# Altium project CRD25DA12N-FMC V1-1 (07-2023).PrjPcb (part 3 of 8)
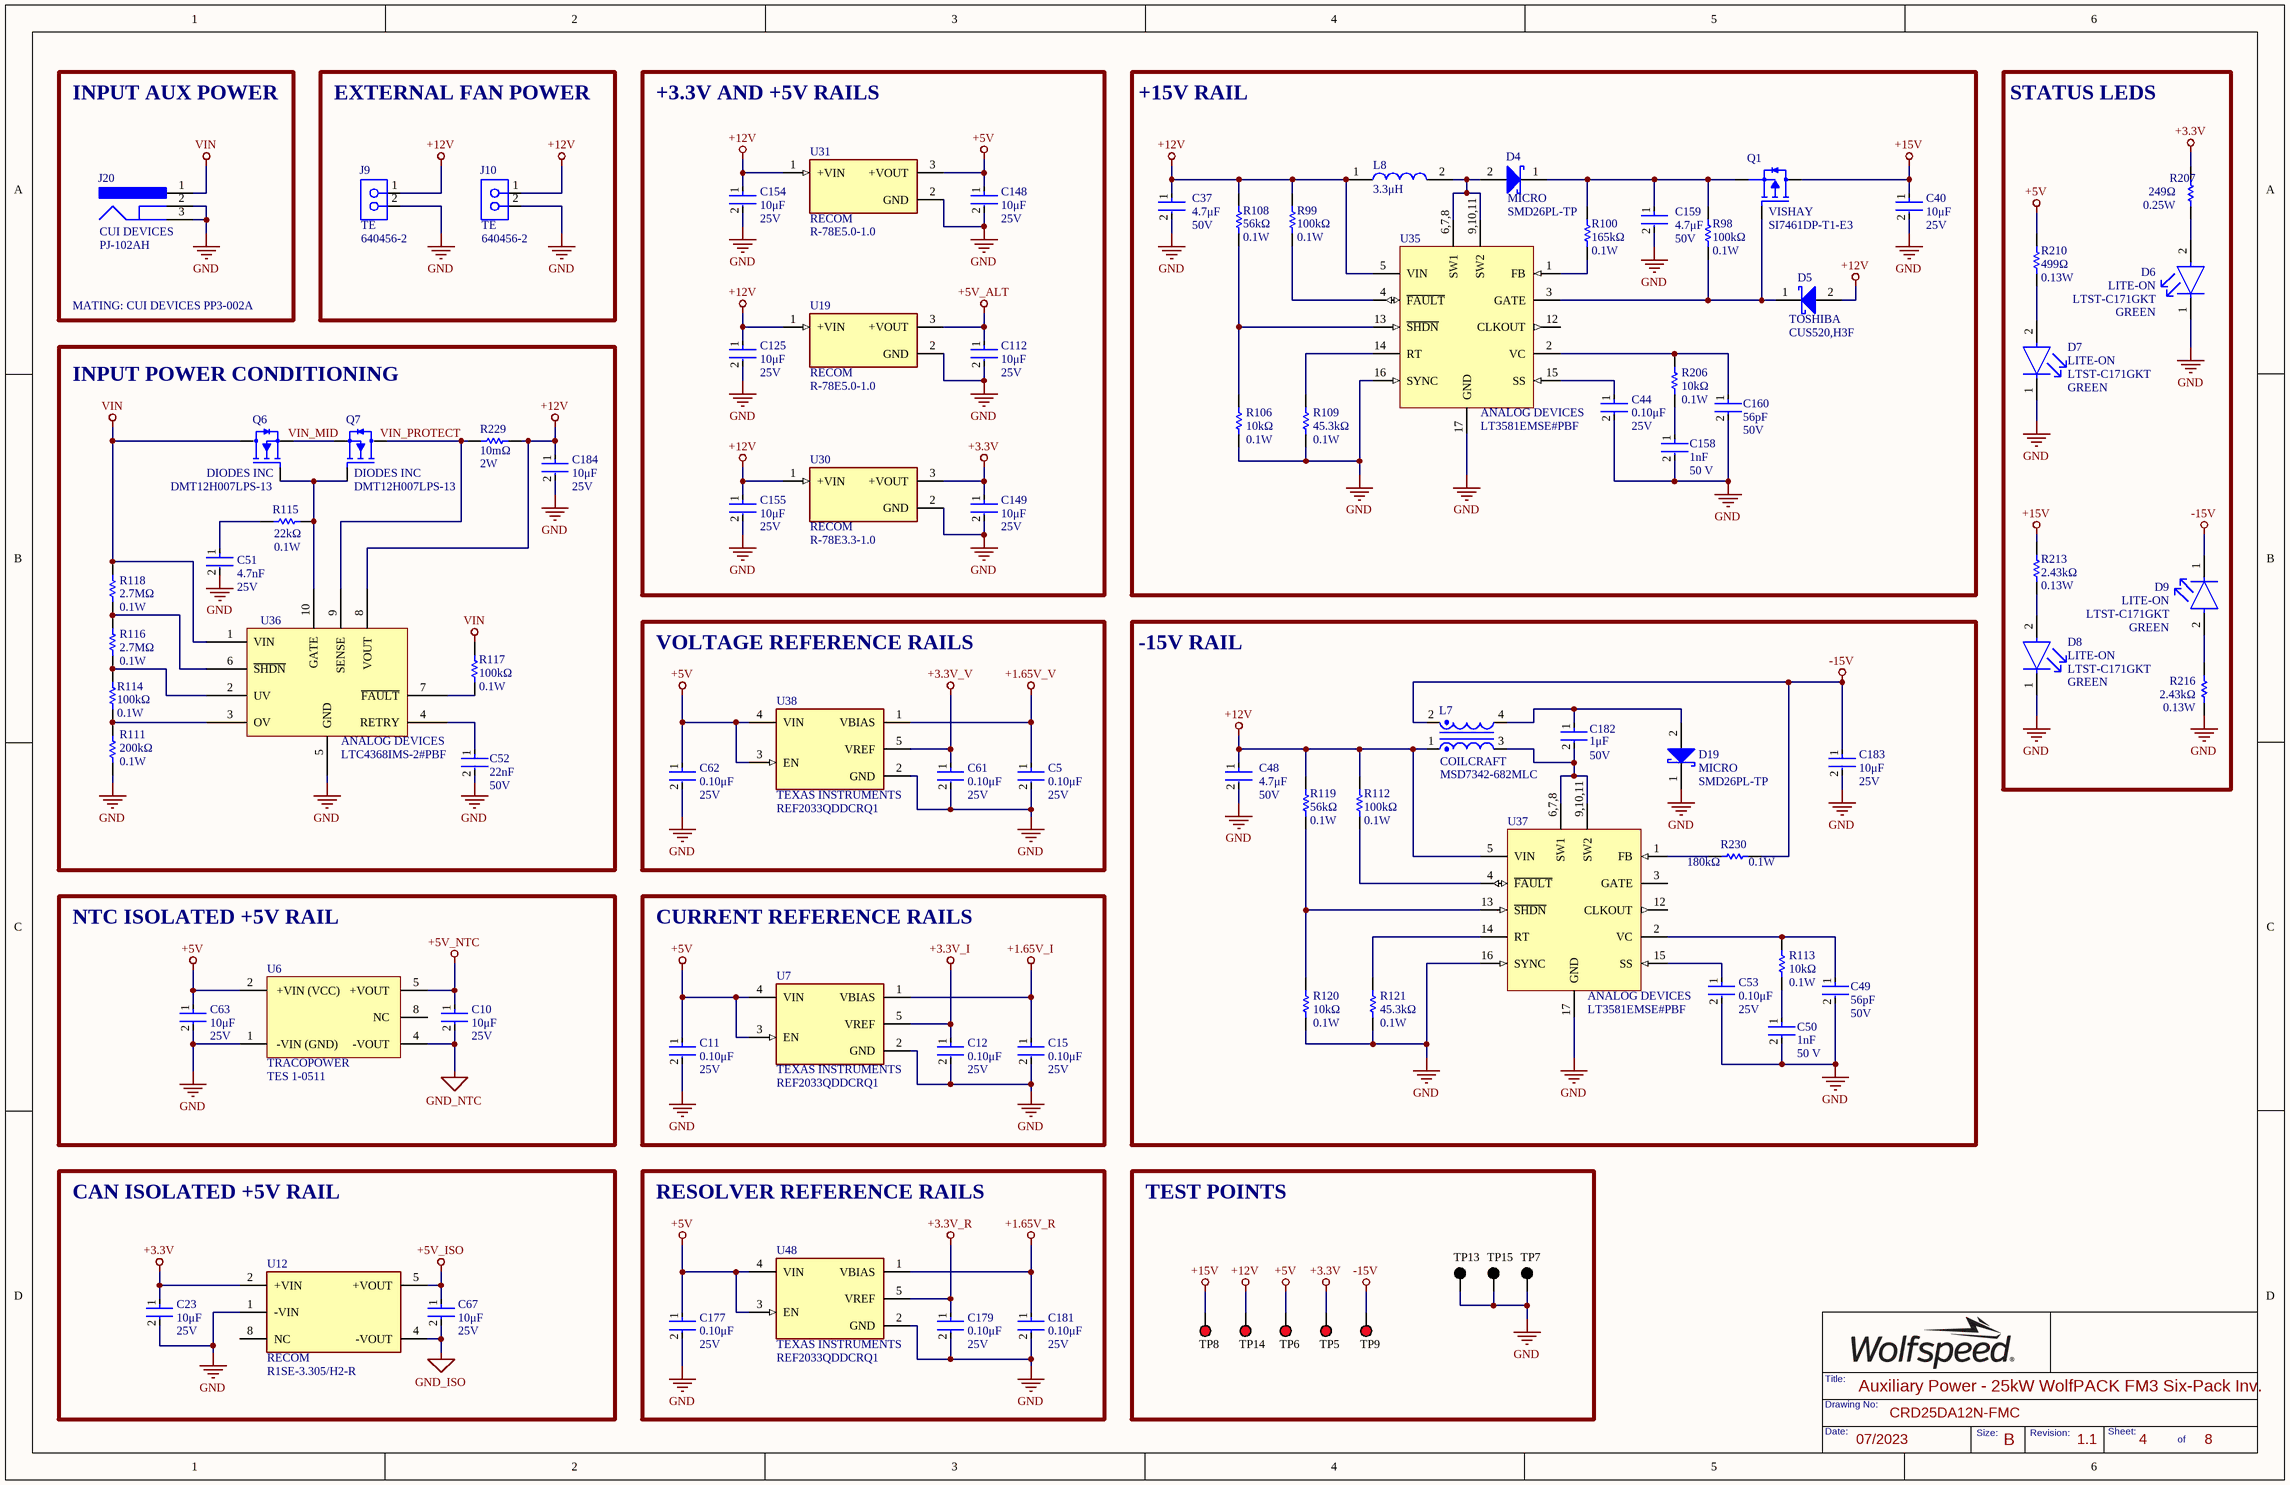
[diagram p8: 04 - Auxiliary Power.SchDoc]

## Sheet 04 - Auxiliary Power.SchDoc: Auxiliary Power - 25kW WolfPACK FM3 Six-Pack Inv. (continued)
### Library data of the parts
C5 C11 C12 C15 C44 C53 C61 C62 C177 C179 C181 = CMP-2006-03057-2: CAP CER 0.1UF 25V X7R 0603; Manufacturer: KEMET; Value: 0.10μF; Material: Ceramic; Tolerance: 0.1; Temperature Coefficient: 30ppm/°C; Automotive Grade: Grade 1; Lead Free: Yes; Device Class L3: Ceramic Capacitors; Manufacturer Part Number: C0603C104K3RACTU; Digikey Description: CAP CER 0.1UF 25V X7R 0603; Mouser Description: Multilayer Ceramic Capacitors MLCC - SMD/SMT 25volts 0.1uF X7R 10%; Package: 0603; Temperature Range Low: -55°C; Automotive: Yes; Device Class L2: Capacitors; Octopart: https://octopart.com/c0603c104k3ractu-kemet-127541; ComponentLink2Description: Datasheet; ComponentLink2URL: https://api.kemet.com/component-edge/download/datasheet/C0603C100J5GACAUTO.pdf; Temperature Range High: +125°C; RoHS: TRUE; Device Class L1: Passive Components; Category: Cap; Temperature: -55°C to +125°C; Height: 0.87mm; Temperature Characteristic: X7R
C10 C23 C40 C63 C67 C112 C125 C148 C149 C154 C155 C183 C184 = CMP-13271-001434-1: CAP CER 10UF 25V X7R 1206; Manufacturer: SAMSUNG; Tolerance: 10%; Value: 10μF; Max Operating Temperature: 125°C; Dielectric: X7R; Min Operating Temperature: -55°C; Height: 1.6mm; Mount: Surface Mount; Width: 0.063inch; Thickness: 0.071inch; Case Code (Metric): 3216; Contact Plating: Tin; Packaging: Tape and Reel; Package: 1206; Case Code (Imperial): 1206; Length: 0.126inch; Radiation Hardening: No; Package Quantity: 1; Depth: 1.6mm; Manufacturer Part Number: CL31B106KAHSFNE
C37 C48 C159 = CMP-13271-001123-1: CAP CER 4.7UF 50V X7R 1206; Manufacturer: SAMSUNG; Tolerance: 10%; Value: 4.7μF; Depth: 1.6mm; Max Operating Temperature: 125°C; Case Code (Metric): 3216; Packaging: Tape and Reel; Mount: Surface Mount; Min Operating Temperature: -55°C; Thickness: 0.071inch; Package: 1206; Length: 3.2mm; Dielectric: X7R; Case Code (Imperial): 1206; Height: 1.6mm; Package Quantity: 1; Radiation Hardening: No; Width: 0.063inch; Manufacturer Part Number: CL31B475KBHNFNE
C49 C160 = CL10C560JB8NNNC: CAP CER 56PF 50V C0G/NP0 0603; Manufacturer: SAMSUNG; Material: Ceramic; Tolerance: 5%; Dielectric: C0G; Temperature Coefficient: 30ppm/°C; Supplier 1: Arrow Electronics; Manufacturer Part Number: CL10C560JB8NNNC; RoHS: Yes; Category: Ceramic Capacitors; Stock 1: 60182; Pricing 1: 1=0.05960, 10=0.01370, 25=0.01360, 100=0.01080, 250=0.01070, 500=0.00740, 1000=0.00590, 3000=0.00560, 6000=0.00530, 15000=0.00500, 30000=0.00470 (USD); Mount: Surface Mount; Case Code (Metric): 1608; Case Code (Imperial): 0603; Min Operating Temperature: -55°C; Max Operating Temperature: 125°C; Packaging: Tape and Reel; Package Quantity: 1; Voltage: 50V; Voltage Rating (DC): 50V; Series: CL; Construction: Flat; Termination: SMD/SMT; Length: 1.6mm; Width: 0.031inch; Height: 0.8mm; Thickness: 0.035inch; Depth: 0.8mm; Radiation Hardening: No; Lead Free: Lead Free; RoHS Compliant: Yes; ComponentLink1URL: https://datasheet.ciiva.com/25803/cl10c560jb8nnnc-25803592.pdf?src-supplier=Digi-Key; ComponentLink1Description: https://datasheet.ciiva.com/25803/cl10c560jb8nnnc-25803592.pdf?src-supplier=Digi-Key; ComponentLink2URL: https://datasheet.ciiva.com/26838/getdatasheetpartid-640760-26838546.pdf?src-supplier=Verical; ComponentLink2Description: https://datasheet.ciiva.com/26838/getdatasheetpartid-640760-26838546.pdf?src-supplier=Verical; ComponentLink3URL: https://datasheet.ciiva.com/29198/456837-da-01-en-vs-kondensator-0603-29198873.pdf?src-supplier=Conrad; ComponentLink3Description: https://datasheet.ciiva.com/29198/456837-da-01-en-vs-kondensator-0603-29198873.pdf?src-supplier=Conrad; ComponentLink4URL: https://datasheet.ciiva.com/48428/mlcc-catalogdownload2013-eng-48428598.pdf?src-supplier=Distrelec; ComponentLink4Description: https://datasheet.ciiva.com/48428/mlcc-catalogdownload2013-eng-48428598.pdf?src-supplier=Distrelec; ComponentLink5URL: https://datasheet.ciiva.com/16449/cl05b104kq5nnnc-16449527.pdf?src-supplier=Future+Electronics; ComponentLink5Description: https://datasheet.ciiva.com/16449/cl05b104kq5nnnc-16449527.pdf?src-supplier=Future+Electronics; Supplier Part Number 1: CL10C560JB8NNNC; Package: 0603; Value: 56pF
C50 C158 = CMP-2006-03716-2: CAP CER 1000PF 50V X7R 0603; Manufacturer: KEMET; Material: Ceramic; Automotive Grade: Grade 1; Value: 1nF; Tolerance: 0.1; Temperature Coefficient: 30ppm/°C; Category: Cap; Automotive: Yes; Temperature Range High: +125°C; Temperature Range Low: -55°C; Temperature Characteristic: X7R; Device Class L1: Passive Components; Height: 0.87mm; Lead Free: Yes; Package: 0603; Digikey Description: CAP CER 1000PF 50V X7R 0603; Manufacturer Part Number: C0603C102K5RACAUTO; ComponentLink2URL: https://api.kemet.com/component-edge/download/datasheet/C0603C100J5GACAUTO.pdf; Mouser Description: Multilayer Ceramic Capacitors MLCC - SMD/SMT 1000pF 50volts 10% X7R AUTO; RoHS: TRUE; Octopart: https://octopart.com/c0603c102k5racauto-kemet-18822673; Device Class L3: Ceramic Capacitors; ComponentLink2Description: Datasheet; Device Class L2: Capacitors; Temperature: -55°C to +125°C
C51 = C0603C472K3RAC7867: CAP CER 4700PF 25V 10% X7R 0603; Manufacturer: KEMET; Manufacturer Part Number: C0603C472K3RACTU; Dielectric Material: Ceramic; Value: 4.7nF; Supplier 1: Newark; RoHS: Yes; Category: Ceramic Capacitors; Stock 1: 8000; Pricing 1: 1=0.04800, 4000=0.04800 (USD); Mount: Surface Mount; Package: 0603; Case Code (Metric): 1608; Case Code (Imperial): 0603; Min Operating Temperature: -55°C; Max Operating Temperature: 125°C; Tolerance: 10%; Dielectric: X7R; Packaging: Tape and Reel; Package Quantity: 1; Voltage Rating (DC): 25V; Termination: SMD/SMT; Dissipation Factor: 10%; Series: C; Construction: Flat; Length: 1.6mm; Width: 0.031inch; Height: 0.8mm; Thickness: 0.034inch; Lead Pitch: 0.7mm; Depth: 0.8mm; Radiation Hardening: No; Reach SVHC Compliant: Yes; RoHS Compliant: Yes; ComponentLink1URL: https://datasheet.ciiva.com/5414/kem-c1002-x7r-smd-357932-5414293.pdf?src-supplier=Mouser; ComponentLink1Description: https://datasheet.ciiva.com/5414/kem-c1002-x7r-smd-357932-5414293.pdf?src-supplier=Mouser; Supplier Part Number 1: 67AH9250
C52 = CC0805KRX7R9BB223: CAP CER 0.022UF 50V X7R 0805; Manufacturer: YAGEO; Material: Ceramic; Tolerance: 10%; Insulation Resistance: 100GR; Value: 22nF; Supplier 1: Future Electronics; Manufacturer Part Number: CC0805KRX7R9BB223; RoHS: Yes; Category: Ceramic Capacitors; Stock 1: 1604000; Pricing 1: 4000=0.00800, 16000=0.00760, 60000=0.00730, 100000=0.00710, 200000=0.00670 (USD); Mount: Surface Mount; Number of Pins: 2; Case Code (Metric): 2012; Case Code (Imperial): 0805; Dielectric Material: Ceramic; Min Operating Temperature: -55°C; Max Operating Temperature: 125°C; Dielectric: X7R; Voltage Rating: 50V; Packaging: Tape and Reel; Voltage Rating (DC): 50V; Package Quantity: 1; Termination: SMD/SMT; Resistor Type: Ceramic; Series: CC; Length: 2mm; Width: 1.25mm; Height: 0.6mm; Depth: 1.25mm; Thickness: 0.024inch; Radiation Hardening: No; RoHS Compliant: Yes; Reach SVHC Compliant: Yes; Lead Free: Lead Free; Halogen Free: Halogen Free; ComponentLink1URL: https://datasheet.ciiva.com/33738/70765-33738014.pdf?src-supplier=Farnell; ComponentLink1Description: https://datasheet.ciiva.com/33738/70765-33738014.pdf?src-supplier=Farnell; ComponentLink2URL: https://datasheet.ciiva.com/46393/1489800-46393306.pdf?src-supplier=Element14; ComponentLink2Description: https://datasheet.ciiva.com/46393/1489800-46393306.pdf?src-supplier=Element14; ComponentLink3URL: https://datasheet.ciiva.com/7978/1489800-7978213.pdf?src-supplier=Element14; ComponentLink3Description: https://datasheet.ciiva.com/7978/1489800-7978213.pdf?src-supplier=Element14; ComponentLink4URL: https://datasheet.ciiva.com/28450/1489800-28450821.pdf?src-supplier=Element14; ComponentLink4Description: https://datasheet.ciiva.com/28450/1489800-28450821.pdf?src-supplier=Element14; ComponentLink5URL: https://datasheet.ciiva.com/144/mlccorderingcode-144788.pdf?src-supplier=Digi-Key; ComponentLink5Description: https://datasheet.ciiva.com/144/mlccorderingcode-144788.pdf?src-supplier=Digi-Key; ComponentLink6URL: https://datasheet.ciiva.com/144/mlccorderingcode-144787.pdf?src-supplier=Digi-Key; ComponentLink6Description: https://datasheet.ciiva.com/144/mlccorderingcode-144787.pdf?src-supplier=Digi-Key; ComponentLink7URL: https://datasheet.ciiva.com/144/mlccorderingcode-144789.pdf?src-supplier=Digi-Key; ComponentLink7Description: https://datasheet.ciiva.com/144/mlccorderingcode-144789.pdf?src-supplier=Digi-Key; ComponentLink8URL: https://datasheet.ciiva.com/46392/1489800-46392565.pdf?src-supplier=Element14; ComponentLink8Description: https://datasheet.ciiva.com/46392/1489800-46392565.pdf?src-supplier=Element14; ComponentLink9URL: https://datasheet.ciiva.com/11464/upy-gphc-x7r-6-3v-to-50v-8-11464758.pdf?src-supplier=Avnet; ComponentLink9Description: https://datasheet.ciiva.com/11464/upy-gphc-x7r-6-3v-to-50v-8-11464758.pdf?src-supplier=Avnet; ComponentLink10URL: https://datasheet.ciiva.com/15189/getdatasheetpartid-343434-15189228.pdf?src-supplier=Verical; ComponentLink10Description: https://datasheet.ciiva.com/15189/getdatasheetpartid-343434-15189228.pdf?src-supplier=Verical; ComponentLink11URL: https://datasheet.ciiva.com/29242/445416-da-01-en-kerko-chip-0805-x7r-0-022uf-10proz50vg-29242108.pdf?src-supplier=Conrad; ComponentLink11Description: https://datasheet.ciiva.com/29242/445416-da-01-en-kerko-chip-0805-x7r-0-022uf-10proz50vg-29242108.pdf?src-supplier=Conrad; Supplier Part Number 1: 2104784; Package: 0805
C182 = CL21B105KBFNNNE: CAP CER 1UF 50V X7R 0805; Manufacturer: SAMSUNG; Tolerance: 10%; Value: 1μF; Supplier 1: Newark; Manufacturer Part Number: CL21B105KBFNNNE; RoHS: Yes; Category: Ceramic Capacitors; Stock 1: 42000; Pricing 1: 1=0.01000, 2000=0.01000, 4000=0.01000 (USD); Mount: Surface Mount; Case/Package: 0805; Case Code (Metric): 2012; Case Code (Imperial): 0805; Min Operating Temperature: -55°C; Max Operating Temperature: 125°C; Packaging: Tape and Reel; Package Quantity: 1; Voltage Rating: 50V; Dielectric: X7R; Series: CL; Construction: Flat; Length: 2mm; Width: 0.049inch; Height: 1.25mm; Thickness: 0.053inch; Depth: 1.25mm; Radiation Hardening: No; RoHS Compliant: Yes; ComponentLink1URL: https://datasheet.ciiva.com/25800/cl21b105kbfnnne-25800291.pdf?src-supplier=Digi-Key; ComponentLink1Description: https://datasheet.ciiva.com/25800/cl21b105kbfnnne-25800291.pdf?src-supplier=Digi-Key; ComponentLink2URL: https://datasheet.ciiva.com/16449/cl21b105kbfnnne-16449003.pdf?src-supplier=Future+Electronics; ComponentLink2Description: https://datasheet.ciiva.com/16449/cl21b105kbfnnne-16449003.pdf?src-supplier=Future+Electronics; ComponentLink3URL: https://datasheet.ciiva.com/26838/getdatasheetpartid-354075-26838668.pdf?src-supplier=Verical; ComponentLink3Description: https://datasheet.ciiva.com/26838/getdatasheetpartid-354075-26838668.pdf?src-supplier=Verical; Supplier Part Number 1: 82AC9436; Package: 0805
D4 D19 = SMD26PL-TP: DIODE SCHOTTKY 60V 2A SOD123FL; Manufacturer: MICRO COMMERCIAL; Forward Voltage: 700mV; Max Reverse Current: 500uA; Max Surge Current: 50A; Max Power Dissipation: 1.68W; Supplier 1: Digi-Key; Manufacturer Part Number: SMD26PL-TP; RoHS: Yes; Category: Rectifier Diodes; Stock 1: 317348; Pricing 1: 1=0.40000, 10=0.30200, 100=0.18790, 500=0.12854, 1000=0.09888 (USD); Mount: Surface Mount; Number of Pins: 2; Min Operating Temperature: -65°C; Max Operating Temperature: 125°C; Packaging: Tape and Reel; Package Quantity: 1; Average Rectified Current: 2A; Max Repetitive Reverse Voltage (Vrrm): 60V; Max Reverse Voltage (DC): 60V; Lead Free: Lead Free; RoHS Compliant: Yes; ComponentLink1URL: https://datasheet.ciiva.com/4717/smd22pl-smd210plsod-123fl-27814-4717414.pdf?src-supplier=Mouser; ComponentLink1Description: https://datasheet.ciiva.com/4717/smd22pl-smd210plsod-123fl-27814-4717414.pdf?src-supplier=Mouser; ComponentLink2URL: https://datasheet.ciiva.com/17444/smd22pl-smd210plsod-123fl-17444944.pdf?src-supplier=Future+Electronics; ComponentLink2Description: https://datasheet.ciiva.com/17444/smd22pl-smd210plsod-123fl-17444944.pdf?src-supplier=Future+Electronics; ComponentLink3URL: https://datasheet.ciiva.com/917/smd22pl-smd210plsod-123fl-917242.pdf?src-supplier=Digi-Key; ComponentLink3Description: https://datasheet.ciiva.com/917/smd22pl-smd210plsod-123fl-917242.pdf?src-supplier=Digi-Key; ComponentLink4URL: https://datasheet.ciiva.com/917/smd22pl-smd210plsod-123fl-917243.pdf?src-supplier=Digi-Key; ComponentLink4Description: https://datasheet.ciiva.com/917/smd22pl-smd210plsod-123fl-917243.pdf?src-supplier=Digi-Key; ComponentLink5URL: https://datasheet.ciiva.com/917/smd22pl-smd210plsod-123fl-917244.pdf?src-supplier=Digi-Key; ComponentLink5Description: https://datasheet.ciiva.com/917/smd22pl-smd210plsod-123fl-917244.pdf?src-supplier=Digi-Key; Supplier Part Number 1: SMD26PL-TPMSCT-ND; Value: N/A; Package: SOD-123F
D5 = CUS520,H3F: DIODE SCHOTTKY 30V 200MA USC; Element Configuration: Single; Max Reverse Current: 5uA; Peak Non-Repetitive Surge Current: 1A; Supplier 1: Digi-Key; Manufacturer: TOSHIBA; Manufacturer Part Number: CUS520,H3F; RoHS: No; Category: Rectifier Diodes; Stock 1: 267256; Pricing 1: 1=0.20000, 10=0.16600, 100=0.08810, 500=0.05794, 1000=0.03940 (USD); Mount: Surface Mount; Number of Pins: 2; Contact Plating: Tin,Silver; Min Operating Temperature: -40°C; Max Operating Temperature: 100°C; Packaging: Tape and Reel; Average Rectified Current: 200mA; Max Repetitive Reverse Voltage (Vrrm): 30V; Max Reverse Voltage (DC): 30V; RoHS Compliant: No; ComponentLink1URL: https://toshiba.semicon-storage.com/info/docget.jsp?did=7041&prodName=CUS520&src-supplier=Digi-Key; ComponentLink1Description: https://toshiba.semicon-storage.com/info/docget.jsp?did=7041&prodName=CUS520&src-supplier=Digi-Key; ComponentLink2URL: http://toshiba.semicon-storage.com/info/docget.jsp?did=7041&prodName=CUS520&src-supplier=Avnet; ComponentLink2Description: http://toshiba.semicon-storage.com/info/docget.jsp?did=7041&prodName=CUS520&src-supplier=Avnet; ComponentLink3URL: http://toshiba.semicon-storage.com/info/lookup.jsp?pid=CUS520&amp;lang=en&src-supplier=Mouser; ComponentLink3Description: http://toshiba.semicon-storage.com/info/lookup.jsp?pid=CUS520&amp;lang=en&src-supplier=Mouser; Supplier Part Number 1: CUS520H3FCT-ND; Package: SOD-323; Value: N/A
D6-D9 = CMP-22017-000007-1: LED GREEN CLEAR CHIP SMD; Luminous Intensity: 12mcd; Lens Color: Colorless; Dominant Wavelength: 569nm; Number of LEDs: 1; Power Dissipation: 100mW; Viewing Angle: 130°; Reverse Voltage: 5V; Test Current: 10mA; Forward Voltage: 2.1V; Wavelength: 585nm; Lens Style: Diffused; Forward Current: 30mA; Height: 0.8mm; Mount: Surface Mount; Package Quantity: 1; Length: 2mm; Case Code (Metric): 2012; Number of Pins: 2; Number of Elements: 1; Packaging: Tape and Reel; Color: GREEN; Min Operating Temperature: -55°C; Case/Package: 0805; Power Rating: 100mW; Max Operating Temperature: 85°C; Radiation Hardening: No; Depth: 1.25mm; Lens Transparency: Clear; Width: 1.25mm; Lead Free: Lead Free; Case Code (Imperial): 0805; Illumination Color: Green; Manufacturer Part Number: LTST-C171GKT; Package: 0805
J9 J10 = CMP-2000-05417-1: CONN HEADER VERT 2POS 2.54MM; Standards: RoHSCompliant,ELVCompliant,UL94V-0; Material, Housing: Polyester; Agency Approvals: CSA,UL; Brand/Series: MTA-100Series; Contact Centerline Spacing: 0.100 / in.; Material, Contact: CopperAlloy; Current, Rating: 5 / A; Color, Housing: White; Contact Termination Area Plating: Tin; Special Features: Pinstrip; Number of Positions: 2; Pin Spacing: 0.1 / "; Temperature, Operating: -55to+105 / degC; Angle: Straight; Mount Angle: Vertical; Connector Type: MTA-100; Primary Type: InterconnectSystem; Voltage, Rating: 250 / V; Mounting Hole Size: 0.04 / "; Number of Rows: 1; Termination: Solder; Length, Terminal Post: 0.14 / in.; Manufacturer URL: http://www.te.com/; Color: White; Size, Post: 0.025 / in.; Contact Shape: Square; Mounting Type: PCMount; Manufacturer: TE; Datasheet URL: https://datasheet.ciiva.com/11746/0900766b80eb7fdd-11746365.pdf; Type: PCBPlug; Datasheet Version: Rev. W, 06/2004; Number of Contacts: 2; Flammability Rating: UL94V-0; Contact Plating: Tin; Length, Pin: 0.14 / "; Contact Mating Area Plating: Tin; Length, Overall: 0.2 / "; Manufacturer Part Number: 640456-2; Value: N/A; Package: N/A
J20 = PJ-102AH: CONN PWR JACK 2X5.5MM SOLDER; Gender: Male; Shielding: Unshielded; Current Rating: 5A; Voltage Rating: 24V; Insulation Resistance: 50MR; Number of Conductors: 2; Supplier 1: Arrow Electronics; Manufacturer: CUI DEVICES; Manufacturer Part Number: PJ-102AH; RoHS: Yes; Category: Uncategorized; Mount: Through Hole; Color: Black; Contact Material: Copper; Contact Plating: Nickel; Housing Color: Black; Housing Material: Thermoplastic; Min Operating Temperature: -25°C; Max Operating Temperature: 85°C; Package Quantity: 280; Termination: Through Hole; Connector Type: Jack; Contact Gender: Male; Series: -; Orientation: Horizontal; Packaging: Bulk; Diameter: 2.1mm; Flammability Rating: UL94 V-0; Lead Free: Lead Free; RoHS Compliant: Yes; ComponentLink1URL: http://www.mouser.com/ds/2/670/PJ-102AH-524179.pdf?src-supplier=Mouser; ComponentLink1Description: http://www.mouser.com/ds/2/670/PJ-102AH-524179.pdf?src-supplier=Mouser; ComponentLink2URL: https://www.cui.com/product/resource/digikeypdf/pj-102ah.pdf?src-supplier=Digi-Key; ComponentLink2Description: https://www.cui.com/product/resource/digikeypdf/pj-102ah.pdf?src-supplier=Digi-Key; ComponentLink3URL: http://www.cui.com/Product/Resource/FuturePDF/PJ-102AH.pdf?src-supplier=Future+Electronics; ComponentLink3Description: http://www.cui.com/Product/Resource/FuturePDF/PJ-102AH.pdf?src-supplier=Future+Electronics; Supplier Part Number 1: PJ-102AH; Value: N/A; Package: N/A
L7 = MSD7342-682MLC: CMC 6.8UH 2.1A 2LN 70 MOHM SMD; Core Material: Ferrite; Tolerance: 20%; DC Resistance (DCR): 70mR; Inductance - Series: 27.2uH; Value: 6.8μH; Datasheet Link: https://www.coilcraft.com/pdfs/msd7342.pdf; Height: 4.6mm; Manufacturer_Name: COILCRAFT; Manufacturer_Part_Number: MSD7342-682MLC; Supplier 1: Mouser; Manufacturer: COILCRAFT; Manufacturer Part Number: MSD7342-682MLC; RoHS: Yes; Category: Fixed Inductors; Stock 1: 83; Pricing 1: 1=2.61000, 10=2.33000, 50=2.10000, 100=1.94000, 1000=1.33000, 10000=1.31000 (USD); Min Operating Temperature: -40°C; Max Operating Temperature: 85°C; Packaging: Tape and Reel; Package Quantity: 250; Max DC Current: 2.1A; Termination: SMD/SMT; Inductance - Parallel: 6.8uH; Series: MSD7342; Length: 7.5mm; Width: 7.5mm; Lead Free: Contains Lead; RoHS Compliant: Yes; ComponentLink1URL: http://www.mouser.com/ds/2/597/msd7342-220556.pdf?src-supplier=Mouser; ComponentLink1Description: http://www.mouser.com/ds/2/597/msd7342-220556.pdf?src-supplier=Mouser; Supplier Part Number 1: 994-MSD7342-682MLC; Package: N/A
L8 = NRS5040T3R3NMGJ: FIXED IND 3.3UH 3.3A 27 MOHM SMD; Manufacturer_Name: TAIYO YUDEN; Core Material: Ferrite; Saturation Current: 4A; Shielding: Shielded; DC Resistance (DCR): 27mR; Self Resonant Frequency: 32MHz; Test Frequency: 100kHz; Tolerance: 30%; Datasheet Link: https://datasheet.datasheetarchive.com/originals/distributors/DKDS42/DSANUWW0054077.pdf; Height: 4.1mm; Manufacturer_Part_Number: NRS5040T3R3NMGJ; Supplier 1: Avnet; Manufacturer: TAIYO YUDEN; Manufacturer Part Number: NRS5040T3R3NMGJ; RoHS: Yes; Category: Fixed Inductors; Stock 1: 21000; Pricing 1: 1500=0.13148 (USD); Mount: Surface Mount; Case/Package: Nonstandard; Min Operating Temperature: -25°C; Max Operating Temperature: 120°C; Packaging: Tape and Reel; Resistor Type: Wirewound; Inductance: 3.3μH; Current Rating: 3.3A; Max DC Current: 3.3A; Length: 0.193inch; Width: 0.193inch; Height - Seated (Max): 0.161inch; RoHS Compliant: Yes; ComponentLink1URL: https://www.yuden.co.jp/productdata/catalog/wound04_e.pdf?src-supplier=Digi-Key; ComponentLink1Description: https://www.yuden.co.jp/productdata/catalog/wound04_e.pdf?src-supplier=Digi-Key; ComponentLink2URL: http://www.yuden.co.jp/productdata/catalog/en/wound04_e.pdf?src-supplier=Digi-Key; ComponentLink2Description: http://www.yuden.co.jp/productdata/catalog/en/wound04_e.pdf?src-supplier=Digi-Key; Supplier Part Number 1: NRS5040T3R3NMGJ; Package: N/A
Q1 = SI7461DP-T1-E3: MOSFET P-CH 60V 8.6A PPAK SO-8; Rthja Max: 52°C/W; Max Forward Diode Voltage: -1.2V; Depletion Mode: False; Max Junction Temp: +150°C; Pulse Drain Current: -60A; Power Dissipation: 1.9W; Transconductance: 31S; Number Of Channels: 1; Gate Charge At Vgs: 121nC @ -10V; Drain To Source Resistance: 0.0115Ω; Threshold Vgs Min: -1V; Turn Off Delay Time: 205ns; Reverse Recovery Time: 45ns; Standoff Height: 0mm; Continuous Drain Current: -8.6A; Typ Forward Diode Voltage: -0.8V; Turn On Delay Time: 20ns; Gate To Source Voltage: 20V; Drain To Source Voltage: -60V; Threshold Vgs Max: -3V; Mouser Description: MOSFET 60V 14.4A 5.4W 14.5mohm @ 10V; Manufacturer Part Number: SI7461DP-T1-E3; RoHS: TRUE; Package: PowerPAK SO-8; Device Class L3: MOSFETs; ComponentLink2Description: Datasheet; Digikey Description: MOSFET P-CH 60V 8.6A PPAK SO-8; Category: Trans; Lead Free: Yes; Device Class L2: Transistors; Temperature Range High: +150°C; ComponentLink2URL: http://www.vishay.com/docs/72567/si7461dp.pdf; Number Of P Channels: 1; Device Class L1: Discrete Semiconductors; Octopart: https://octopart.com/si7461dp-t1-e3-vishay-42273025; Height: 1.17mm; Temperature Range Low: -55°C; Automotive: No; Temperature: -55°C to +150°C; Value: N/A
Q6 Q7 = DMT12H007LPS-13: MOSFET N-CH 120V 90A PWRDI5060-8; Supplier 1: Newark; Manufacturer Part Number: DMT12H007LPS-13; RoHS: Yes; Category: MOSFETs; Stock 1: 2500; Pricing 1: 1=1.79000, 10=1.60000, 25=1.49000, 50=1.37000, 100=1.25000, 250=1.14000, 500=1.03000, 1000=0.81500 (USD); RoHS Compliant: Yes; Supplier Part Number 1: 68AH9585; Value: N/A; Package: 8-PowerTDFN
R98 R99 R112 R114 R117 = RC0603FR-07100KL: RES 100K OHM 1% 1/10W 0603; Manufacturer: YAGEO; Temperature Coefficient: 100ppm/°C; Voltage Rating: 50V; Working Voltage: 75V; Max Power Dissipation: 100mW; Value: 100kΩ; Supplier 1: Future Electronics; Manufacturer Part Number: RC0603FR-07100KL; RoHS: Yes; Category: Chip SMD Resistors; Stock 1: 39805000; Pricing 1: 5000=0.00150, 50000=0.00140, 200000=0.00140, 625000=0.00130, 2000000=0.00120 (USD); Package: 0603; Number of Pins: 2; Case Code (Imperial): 0603; Case Code (Metric): 1608; Min Operating Temperature: -55°C; Max Operating Temperature: 155°C; Tolerance: 1%; Resistor Type: Thick Film; Voltage Rating (DC): 50V; Packaging: Tape and Reel; Termination: SMD/SMT; Number of Terminations: 2; Features: Moisture Resistant; Series: RC; Resistance Tolerance: 1%; Construction: Rectangular; Technology: THICK FILM; Length: 1.6mm; Width: 0.8mm; Height: 0.45mm; Depth: 0.8mm; Reach SVHC Compliant: Yes; Military Standard: Not; Lead Free: Lead Free; RoHS Compliant: Yes; ComponentLink1URL: https://datasheet.ciiva.com/11808/0900766b80f96399-11808107.pdf?src-supplier=Rs; ComponentLink1Description: https://datasheet.ciiva.com/11808/0900766b80f96399-11808107.pdf?src-supplier=Rs; ComponentLink2URL: https://datasheet.ciiva.com/7983/443971-7983593.pdf?src-supplier=Element14; ComponentLink2Description: https://datasheet.ciiva.com/7983/443971-7983593.pdf?src-supplier=Element14; ComponentLink3URL: https://datasheet.ciiva.com/22747/443971-22747516.pdf?src-supplier=Element14; ComponentLink3Description: https://datasheet.ciiva.com/22747/443971-22747516.pdf?src-supplier=Element14; ComponentLink4URL: https://datasheet.ciiva.com/46440/1868787-46440889.pdf?src-supplier=Element14; ComponentLink4Description: https://datasheet.ciiva.com/46440/1868787-46440889.pdf?src-supplier=Element14; ComponentLink5URL: https://datasheet.ciiva.com/7746/1738695-7746235.pdf?src-supplier=Element14; ComponentLink5Description: https://datasheet.ciiva.com/7746/1738695-7746235.pdf?src-supplier=Element14; ComponentLink6URL: https://datasheet.ciiva.com/7746/1738695-7746234.pdf?src-supplier=Element14; ComponentLink6Description: https://datasheet.ciiva.com/7746/1738695-7746234.pdf?src-supplier=Element14; Supplier Part Number 1: 3697448
R100 = ERJ-3EKF1653V: RES SMD 165K OHM 1% 1/10W 0603; Manufacturer: PANASONIC; Temperature Coefficient: 100ppm/°C; Voltage Rating: 75V; Max Power Dissipation: 100mW; Voltage Rating (DC): 50V; Value: 165kΩ; Supplier 1: Rs; Manufacturer Part Number: ERJ-3EKF1653V; RoHS: Yes; Category: Chip SMD Resistors; Stock 1: 1; Pricing 1: 5000=0.00600 (USD); Mount: Surface Mount; Package: 0603; Contact Plating: Tin; Case Code (Metric): 1608; Case Code (Imperial): 0603; Min Operating Temperature: -55°C; Max Operating Temperature: 155°C; Tolerance: 1%; Resistor Type: Thick Film; Packaging: Tape and Reel; Package Quantity: 1; Number of Terminations: 2; Termination: SMD/SMT; Features: Automotive AEC-Q200; Series: ERJ; Construction: Rectangular; Resistance Tolerance: 1%; Length: 1.6mm; Width: 0.8mm; Height: 0.022inch; Depth: 0.8mm; Radiation Hardening: No; Military Standard: Not; Lead Free: Lead Free; RoHS Compliant: Yes; Reach SVHC Compliant: Yes; ComponentLink1URL: https://datasheet.ciiva.com/7853/aoa0000ce2-7853706.pdf?src-supplier=Element14; ComponentLink1Description: https://datasheet.ciiva.com/7853/aoa0000ce2-7853706.pdf?src-supplier=Element14; ComponentLink2URL: https://datasheet.ciiva.com/22673/1678782-22673385.pdf?src-supplier=Element14; ComponentLink2Description: https://datasheet.ciiva.com/22673/1678782-22673385.pdf?src-supplier=Element14; ComponentLink3URL: https://datasheet.ciiva.com/28531/1694929-28531446.pdf?src-supplier=Element14; ComponentLink3Description: https://datasheet.ciiva.com/28531/1694929-28531446.pdf?src-supplier=Element14; ComponentLink4URL: https://datasheet.ciiva.com/46420/1678782-46420206.pdf?src-supplier=Element14; ComponentLink4Description: https://datasheet.ciiva.com/46420/1678782-46420206.pdf?src-supplier=Element14; ComponentLink5URL: https://datasheet.ciiva.com/16785/70260748-16785381.pdf?src-supplier=Allied+Electronics; ComponentLink5Description: https://datasheet.ciiva.com/16785/70260748-16785381.pdf?src-supplier=Allied+Electronics; ComponentLink6URL: https://datasheet.ciiva.com/15158/getdatasheetpartid-248552-15158986.pdf?src-supplier=Verical; ComponentLink6Description: https://datasheet.ciiva.com/15158/getdatasheetpartid-248552-15158986.pdf?src-supplier=Verical; Supplier Part Number 1: 1058436
R106 R113 R120 R206 = ERJ3EKF1002V: RES SMD 10K OHM 1% 1/10W 0603; Manufacturer: PANASONIC; Manufacturer Part Number: ERJ-3EKF1002V; Temperature Coefficient: 100ppm/°C; Power Rating: 100mW; Voltage Rating: 75V; Value: 10kΩ; Supplier 1: Rs; RoHS: Yes; Category: Chip SMD Resistors; Stock 1: 10000; Mount: Surface Mount; Package: 0603; Number of Pins: 2; Contact Plating: Tin; Case Code (Metric): 1608; Case Code (Imperial): 0603; Size Code: 0603; Min Operating Temperature: -55°C; Max Operating Temperature: 155°C; Tolerance: 1%; Resistor Type: Thick Film; Packaging: Tape and Reel; Package Quantity: 1; Number of Terminations: 2; Termination: SMD/SMT; Voltage Rating (DC): 75V; Features: Automotive AEC-Q200; Series: ERJ; Technology: THICK FILM; Resistance Tolerance: 1%; Construction: Rectangular; Length: 1.6mm; Width: 0.8mm; Height: 0.45mm; Depth: 0.8mm; Radiation Hardening: No; Reach SVHC Compliant: Yes; Military Standard: Not; Lead Free: Lead Free; RoHS Compliant: Yes; ComponentLink1URL: https://datasheet.ciiva.com/7830/aoa0000ce2-7830729.pdf?src-supplier=Element14; ComponentLink1Description: https://datasheet.ciiva.com/7830/aoa0000ce2-7830729.pdf?src-supplier=Element14; ComponentLink2URL: https://datasheet.ciiva.com/46372/1678782-46372725.pdf?src-supplier=Element14; ComponentLink2Description: https://datasheet.ciiva.com/46372/1678782-46372725.pdf?src-supplier=Element14; ComponentLink3URL: https://datasheet.ciiva.com/28514/426256-28514198.pdf?src-supplier=Element14; ComponentLink3Description: https://datasheet.ciiva.com/28514/426256-28514198.pdf?src-supplier=Element14; ComponentLink4URL: https://datasheet.ciiva.com/24070/aoa0000ce2-24070318.pdf?src-supplier=Mouser; ComponentLink4Description: https://datasheet.ciiva.com/24070/aoa0000ce2-24070318.pdf?src-supplier=Mouser; ComponentLink5URL: https://datasheet.ciiva.com/16759/70260748-16759807.pdf?src-supplier=Allied+Electronics; ComponentLink5Description: https://datasheet.ciiva.com/16759/70260748-16759807.pdf?src-supplier=Allied+Electronics; ComponentLink6URL: https://datasheet.ciiva.com/9194/aoa0000ce2-9194199.pdf?src-supplier=Avnet; ComponentLink6Description: https://datasheet.ciiva.com/9194/aoa0000ce2-9194199.pdf?src-supplier=Avnet; ComponentLink7URL: https://datasheet.ciiva.com/48530/aoa0000ce2-48530988.pdf?src-supplier=Avnet; ComponentLink7Description: https://datasheet.ciiva.com/48530/aoa0000ce2-48530988.pdf?src-supplier=Avnet; ComponentLink8URL: https://datasheet.ciiva.com/30208/aoa0000ce2-30208985.pdf?src-supplier=Onlinecomponents.com; ComponentLink8Description: https://datasheet.ciiva.com/30208/aoa0000ce2-30208985.pdf?src-supplier=Onlinecomponents.com; Supplier Part Number 1: 1051156
R108 R119 = RC0603FR-0756KL: RES 56K OHM 1% 1/10W 0603; Manufacturer: YAGEO; Voltage Rating (DC): 50V; Voltage Rating: 75V; Temperature Coefficient: 100ppm/°C; Max Power Dissipation: 100mW; Value: 56kΩ; Supplier 1: Future Electronics; Manufacturer Part Number: RC0603FR-0756KL; RoHS: Yes; Category: Chip SMD Resistors; Stock 1: 11945000; Pricing 1: 5000=0.00150, 50000=0.00140, 200000=0.00140, 625000=0.00130, 2000000=0.00120 (USD); Package: 0603; Number of Pins: 2; Case Code (Metric): 1608; Case Code (Imperial): 0603; Weight: 7.1E-05oz; Size Code: 0603; Min Operating Temperature: -55°C; Max Operating Temperature: 155°C; Tolerance: 1%; Packaging: Tape and Reel; Package Quantity: 1; Resistor Type: Thick Film; Number of Terminations: 2; Termination: SMD/SMT; Features: Moisture Resistant; Series: RC; Resistance Tolerance: 1%; Construction: Rectangular; Length: 1.6mm; Width: 0.8mm; Height: 0.45mm; Depth: 0.8mm; Military Standard: Not; Lead Free: Lead Free; RoHS Compliant: Yes; ComponentLink1URL: https://datasheet.ciiva.com/2508/pyu-r-int-thick-7-2508519.pdf?src-supplier=Digi-Key; ComponentLink1Description: https://datasheet.ciiva.com/2508/pyu-r-int-thick-7-2508519.pdf?src-supplier=Digi-Key; ComponentLink2URL: https://datasheet.ciiva.com/2508/pyu-r-int-thick-7-2508520.pdf?src-supplier=Digi-Key; ComponentLink2Description: https://datasheet.ciiva.com/2508/pyu-r-int-thick-7-2508520.pdf?src-supplier=Digi-Key; ComponentLink3URL: https://datasheet.ciiva.com/2508/pyu-r-int-thick-7-2508518.pdf?src-supplier=Digi-Key; ComponentLink3Description: https://datasheet.ciiva.com/2508/pyu-r-int-thick-7-2508518.pdf?src-supplier=Digi-Key; ComponentLink4URL: https://datasheet.ciiva.com/7746/443971-7746377.pdf?src-supplier=Element14; ComponentLink4Description: https://datasheet.ciiva.com/7746/443971-7746377.pdf?src-supplier=Element14; ComponentLink5URL: https://datasheet.ciiva.com/7746/443971-7746376.pdf?src-supplier=Element14; ComponentLink5Description: https://datasheet.ciiva.com/7746/443971-7746376.pdf?src-supplier=Element14; Supplier Part Number 1: 7874498
R109 R121 = RMCF0603FT45K3: RES 45.3K OHM 1% 1/10W 0603; Manufacturer: STACKPOLE; Temperature Coefficient: 100ppm/°C; Value: 45.3kΩ; Mount: Surface Mount; Contact Plating: Tin; Tolerance: 1%; Series: RMCF; Max Operating Temperature: 155°C; RoHS Compliant: Yes; Package: 0603; Features: Automotive AEC-Q200; Width: 0.031inch; Lead Free: Contains Lead; Height: 0.022inch; Radiation Hardening: No; Number of Terminations: 2; Length: 0.061inch; Min Operating Temperature: -55°C; Case Code (Imperial): 0603; Resistor Type: Thick Film; Case Code (Metric): 1608; Packaging: Tape and Reel; Manufacturer Part Number: RMCF0603FT45K3
R111 = ERJ-3EKF2003V: RES SMD 200K OHM 1% 1/10W 0603; Manufacturer: PANASONIC; Temperature Coefficient: 100ppm/°C; Power Rating: 100mW; Voltage Rating: 75V; Voltage Rating (DC): 50V; Value: 200kΩ; Supplier 1: Newark; Manufacturer Part Number: ERJ-3EKF2003V; RoHS: Yes; Category: Chip SMD Resistors; Stock 1: 195000; Pricing 1: 5000=0.00500, 10000=0.00500 (USD); Mount: Surface Mount; Package: 0603; Contact Plating: Tin; Case Code (Metric): 1608; Case Code (Imperial): 0603; Min Operating Temperature: -55°C; Max Operating Temperature: 155°C; Tolerance: 1%; Resistor Type: Thick Film; Packaging: Cut Tape; Package Quantity: 1; Number of Terminations: 2; Termination: SMD/SMT; Working Voltage: 75V; Features: Automotive AEC-Q200; Series: ERJ; Construction: Rectangular; Resistance Tolerance: 1%; Technology: THICK FILM; Length: 1.6mm; Width: 0.8mm; Height: 0.022inch; Depth: 0.8mm; Radiation Hardening: No; Reach SVHC Compliant: Yes; Military Standard: Not; Lead Free: Lead Free; RoHS Compliant: Yes; ComponentLink1URL: https://datasheet.ciiva.com/46387/426256-46387278.pdf?src-supplier=Element14; ComponentLink1Description: https://datasheet.ciiva.com/46387/426256-46387278.pdf?src-supplier=Element14; ComponentLink2URL: https://datasheet.ciiva.com/5868/426256-5868137.pdf?src-supplier=Farnell; ComponentLink2Description: https://datasheet.ciiva.com/5868/426256-5868137.pdf?src-supplier=Farnell; ComponentLink3URL: https://datasheet.ciiva.com/46374/426256-46374238.pdf?src-supplier=Element14; ComponentLink3Description: https://datasheet.ciiva.com/46374/426256-46374238.pdf?src-supplier=Element14; ComponentLink4URL: https://datasheet.ciiva.com/24068/aoa0000ce2-24068783.pdf?src-supplier=Mouser; ComponentLink4Description: https://datasheet.ciiva.com/24068/aoa0000ce2-24068783.pdf?src-supplier=Mouser; ComponentLink5URL: https://datasheet.ciiva.com/16785/70260748-16785079.pdf?src-supplier=Allied+Electronics; ComponentLink5Description: https://datasheet.ciiva.com/16785/70260748-16785079.pdf?src-supplier=Allied+Electronics; ComponentLink6URL: https://datasheet.ciiva.com/16758/70260748-16758091.pdf?src-supplier=Allied+Electronics; ComponentLink6Description: https://datasheet.ciiva.com/16758/70260748-16758091.pdf?src-supplier=Allied+Electronics; ComponentLink7URL: https://datasheet.ciiva.com/16199/aoa0000ce2-16199899.pdf?src-supplier=Future+Electronics; ComponentLink7Description: https://datasheet.ciiva.com/16199/aoa0000ce2-16199899.pdf?src-supplier=Future+Electronics; ComponentLink8URL: https://datasheet.ciiva.com/30113/aoa0000ce2-30113838.pdf?src-supplier=Onlinecomponents.com; ComponentLink8Description: https://datasheet.ciiva.com/30113/aoa0000ce2-30113838.pdf?src-supplier=Onlinecomponents.com; Supplier Part Number 1: 25AC9147
R115 = CMP-2000-00337-2: RES SMD 22K OHM 1% 1/10W 0603; Manufacturer: PANASONIC; Voltage Rating: 50 V; Value: 22kΩ; ComponentLink2Description: Datasheet; PackageDescription: 2-Pin Surface Mount Device, Body 1.6 x 0.85 mm; Length: 1.6 mm; Package Quantity: 200; ComponentLink1Description: Manufacturer URL; Width: 0.8 mm; Tolerance: 1%; ComponentLink2URL: http://industrial.panasonic.com/cdbs/www-data/pdf/RDA0000/AOA0000C86.pdf; Case Code (Metric): 1608; Case Code (Imperial): 0603; Package: 0603; PackageReference: 0603; DatasheetVersion: Apr-15; Packaging: Tape and Reel; Max Operating Temperature: 155 degC; Height: 0.45 mm; ComponentLink1URL: http://www.panasonic.com/; Min Operating Temperature: -55 degC; RoHSCompliant: true; Manufacturer Part Number: ERJ-3EKF2202V
R116 R118 = RC0603JR-072M7L: RES 2.7M OHM 5% 1/10W 0603; Manufacturer: YAGEO; Temperature Coefficient: 100ppm/°C; Voltage Rating: 75V; Max Power Dissipation: 100mW; Voltage Rating (DC): 50V; Value: 2.7MΩ; Supplier 1: Arrow Electronics; Manufacturer Part Number: RC0603JR-072M7L; RoHS: Yes; Category: Chip SMD Resistors; Stock 1: 12804; Pricing 1: 1=0.04340, 10=0.00650, 100=0.00220, 500=0.00210, 1000=0.00140, 3000=0.00110, 6000=0.00090 (USD); Package: 0603; Contact Plating: Tin,Matte; Case Code (Imperial): 0603; Case Code (Metric): 1608; Weight: 7.1E-05oz; Size Code: 0603; Min Operating Temperature: -55°C; Max Operating Temperature: 155°C; Tolerance: 5%; Resistor Type: Thick Film; Packaging: Tape and Reel; Package Quantity: 1; Termination: SMD/SMT; Number of Terminations: 2; Features: Moisture Resistant; Series: RC; Construction: Rectangular; Length: 1.6mm; Width: 0.8mm; Height: 0.022inch; Depth: 0.8mm; Radiation Hardening: No; Military Standard: Not; Lead Free: Lead Free; RoHS Compliant: Yes; ComponentLink1URL: https://datasheet.ciiva.com/2453/pyu-r-int-thick-7-2453209.pdf?src-supplier=Digi-Key; ComponentLink1Description: https://datasheet.ciiva.com/2453/pyu-r-int-thick-7-2453209.pdf?src-supplier=Digi-Key; ComponentLink2URL: https://datasheet.ciiva.com/2453/pyu-r-int-thick-7-2453210.pdf?src-supplier=Digi-Key; ComponentLink2Description: https://datasheet.ciiva.com/2453/pyu-r-int-thick-7-2453210.pdf?src-supplier=Digi-Key; ComponentLink3URL: https://datasheet.ciiva.com/2453/pyu-r-int-thick-7-2453208.pdf?src-supplier=Digi-Key; ComponentLink3Description: https://datasheet.ciiva.com/2453/pyu-r-int-thick-7-2453208.pdf?src-supplier=Digi-Key; Supplier Part Number 1: RC0603JR-072M7L
R207 = RC1206FR-07249RL: RES 249 OHM 1% 1/4W 1206; Manufacturer: YAGEO; Voltage Rating: 200V; Temperature Coefficient: 100ppm/°C; Max Power Dissipation: 250mW; Value: 249Ω; Supplier 1: Future Electronics; Manufacturer Part Number: RC1206FR-07249RL; RoHS: Yes; Category: Chip SMD Resistors; Stock 1: 560000; Pricing 1: 5000=0.00430, 25000=0.00410, 100000=0.00390, 250000=0.00370, 625000=0.00350 (USD); Package: 1206; Case Code (Imperial): 1206; Case Code (Metric): 3216; Size Code: 1206; Min Operating Temperature: -55°C; Max Operating Temperature: 155°C; Tolerance: 1%; Packaging: Tape and Reel; Termination: SMD/SMT; Resistor Type: Thick Film; Voltage Rating (DC): 200V; Features: Moisture Resistant; Series: RC; Number of Terminations: 2; Construction: Rectangular; Length: 3.1mm; Depth: 1.6mm; Military Standard: Not; Lead Free: Lead Free; RoHS Compliant: Yes; ComponentLink1URL: https://datasheet.ciiva.com/16747/pyu-rc1206-51-rohs-l-4-16747103.pdf?src-supplier=Future+Electronics; ComponentLink1Description: https://datasheet.ciiva.com/16747/pyu-rc1206-51-rohs-l-4-16747103.pdf?src-supplier=Future+Electronics; Supplier Part Number 1: 1142064
R210 = RC0805FR-07499RL: RES 499 OHM 1% 1/8W 0805; Manufacturer: YAGEO; Power Rating: 125mW; Voltage Rating: 150V; Temperature Coefficient: 100ppm/°C; Value: 499Ω; Supplier 1: Future Electronics; Manufacturer Part Number: RC0805FR-07499RL; RoHS: Yes; Category: Chip SMD Resistors; Stock 1: 275000; Pricing 1: 5000=0.00270, 25000=0.00260, 125000=0.00240, 150000=0.00240, 500000=0.00230, 1250000=0.00210, 1500000=0.00210 (USD); Mount: Surface Mount; Package: 0805; Case Code (Metric): 2012; Case Code (Imperial): 0805; Size Code: 0805; Min Operating Temperature: -55°C; Max Operating Temperature: 155°C; Tolerance: 1%; Package Quantity: 1; Packaging: Tape and Reel; Resistor Type: Thick Film; Number of Terminations: 2; Termination: SMD/SMT; Voltage Rating (DC): 150V; Features: Moisture Resistant; Series: RC; Technology: THICK FILM; Construction: Rectangular; Length: 0.079inch; Width: 0.049inch; Height: 0.024inch; Depth: 1.25mm; Military Standard: Not; Lead Free: Lead Free; RoHS Compliant: Yes; ComponentLink1URL: https://datasheet.ciiva.com/2457/pyu-r-int-thick-7-2457414.pdf?src-supplier=Digi-Key; ComponentLink1Description: https://datasheet.ciiva.com/2457/pyu-r-int-thick-7-2457414.pdf?src-supplier=Digi-Key; ComponentLink2URL: https://datasheet.ciiva.com/2457/pyu-r-int-thick-7-2457415.pdf?src-supplier=Digi-Key; ComponentLink2Description: https://datasheet.ciiva.com/2457/pyu-r-int-thick-7-2457415.pdf?src-supplier=Digi-Key; ComponentLink3URL: https://datasheet.ciiva.com/2457/pyu-r-int-thick-7-2457413.pdf?src-supplier=Digi-Key; ComponentLink3Description: https://datasheet.ciiva.com/2457/pyu-r-int-thick-7-2457413.pdf?src-supplier=Digi-Key; ComponentLink4URL: https://datasheet.ciiva.com/12667/rc0805-12667322.pdf?src-supplier=Mouser; ComponentLink4Description: https://datasheet.ciiva.com/12667/rc0805-12667322.pdf?src-supplier=Mouser; Supplier Part Number 1: 5825161
R213 R216 = ERJ-6ENF2431V: RES SMD 2.43K OHM 1% 1/8W 0805; Manufacturer: PANASONIC; Temperature Coefficient: 100ppm/°C; Voltage Rating: 150V; Max Power Dissipation: 125mW; Value: 2.43kΩ; Supplier 1: Newark; Manufacturer Part Number: ERJ-6ENF2431V; RoHS: Yes; Category: Chip SMD Resistors; Stock 1: 30000; Pricing 1: 1=0.02500, 5000=0.02200, 10000=0.01700, 20000=0.01300 (USD); Mount: Surface Mount; Package: 0805; Contact Plating: Tin; Case Code (Metric): 2012; Case Code (Imperial): 0805; Min Operating Temperature: -55°C; Max Operating Temperature: 155°C; Tolerance: 1%; Resistor Type: Thick Film; Packaging: Tape and Reel; Package Quantity: 1; Number of Terminations: 2; Termination: SMD/SMT; Voltage Rating (DC): 150V; Features: Automotive AEC-Q200; Series: ERJ; Construction: Rectangular; Resistance Tolerance: 1%; Technology: THICK FILM; Length: 2mm; Width: 0.049inch; Height: 0.6mm; Depth: 1.25mm; Radiation Hardening: No; Reach SVHC Compliant: Yes; Military Standard: Not; Lead Free: Lead Free; RoHS Compliant: Yes; ComponentLink1URL: https://datasheet.ciiva.com/7763/1678782-7763735.pdf?src-supplier=Element14; ComponentLink1Description: https://datasheet.ciiva.com/7763/1678782-7763735.pdf?src-supplier=Element14; ComponentLink2URL: https://datasheet.ciiva.com/22681/1678782-22681333.pdf?src-supplier=Element14; ComponentLink2Description: https://datasheet.ciiva.com/22681/1678782-22681333.pdf?src-supplier=Element14; ComponentLink3URL: https://datasheet.ciiva.com/28594/1694929-28594725.pdf?src-supplier=Element14; ComponentLink3Description: https://datasheet.ciiva.com/28594/1694929-28594725.pdf?src-supplier=Element14; ComponentLink4URL: https://datasheet.ciiva.com/46441/1678782-46441274.pdf?src-supplier=Element14; ComponentLink4Description: https://datasheet.ciiva.com/46441/1678782-46441274.pdf?src-supplier=Element14; ComponentLink5URL: https://datasheet.ciiva.com/16773/70260748-16773928.pdf?src-supplier=Allied+Electronics; ComponentLink5Description: https://datasheet.ciiva.com/16773/70260748-16773928.pdf?src-supplier=Allied+Electronics; ComponentLink6URL: https://datasheet.ciiva.com/16783/70260748-16783546.pdf?src-supplier=Allied+Electronics; ComponentLink6Description: https://datasheet.ciiva.com/16783/70260748-16783546.pdf?src-supplier=Allied+Electronics; ComponentLink7URL: https://datasheet.ciiva.com/30086/aoa0000ce2-30086726.pdf?src-supplier=Onlinecomponents.com; ComponentLink7Description: https://datasheet.ciiva.com/30086/aoa0000ce2-30086726.pdf?src-supplier=Onlinecomponents.com; Supplier Part Number 1: 73AC7648
R229 = PE2512FKE7W0R01L: RES 0.01 OHM 1% 2W 2512; Manufacturer: YAGEO; Temperature Coefficient: 50ppm/°C; Value: 10mΩ; Supplier 1: Rs; Manufacturer Part Number: PE2512FKE7W0R01L; RoHS: Yes; Category: Chip SMD Resistors; Stock 1: 2110; Package: 2512; Case Code (Metric): 6432; Case Code (Imperial): 2512; Min Operating Temperature: -55°C; Max Operating Temperature: 170°C; Packaging: Tape and Reel; Resistor Type: Metal Film; Number of Terminations: 2; Tolerance: 1%; Features: Moisture Resistant,Automotive AEC-Q200; Length: 0.248inch; Width: 0.122inch; Height: 0.03inch; Lead Free: Lead Free; ComponentLink1URL: http://www.mouser.com/ds/2/447/PYu-PE_521_RoHS_L_1-536447.pdf?src-supplier=Mouser; ComponentLink1Description: http://www.mouser.com/ds/2/447/PYu-PE_521_RoHS_L_1-536447.pdf?src-supplier=Mouser; ComponentLink2URL: http://www.yageo.com/NewPortal/yageodocoutput?fileName=/pdf/R-Chip/PYu-PE_521_RoHS_L_5.pdf&src-supplier=Digi-Key; ComponentLink2Description: http://www.yageo.com/NewPortal/yageodocoutput?fileName=/pdf/R-Chip/PYu-PE_521_RoHS_L_5.pdf&src-supplier=Digi-Key; Supplier Part Number 1: 1995902P
R230 = CRGCQ0603F180K: RES 180K OHM 1% 1/10W 0603; Manufacturer: TE; Temperature Coefficient: 100ppm/°C; Value: 180kΩ; Supplier 1: Newark; Manufacturer Part Number: CRGCQ0603F180K; RoHS: Yes; Category: Chip SMD Resistors; Stock 1: 4310; Pricing 1: 1=0.00100, 25=0.00100, 100=0.00100, 250=0.00100, 500=0.00100, 1000=0.00100 (USD); Package: 0603; Case Code (Imperial): 0603; Case Code (Metric): 1608; Min Operating Temperature: -55°C; Max Operating Temperature: 155°C; Resistor Type: Thick Film; Features: Moisture Resistant,Automotive AEC-Q200; Packaging: Cut Tape; Tolerance: 1%; Number of Terminations: 2; RoHS Compliant: Yes; ComponentLink1URL: https://4donline.ihs.com/images/VipMasterIC/IC/TYEL/TYEL-S-A0004929575/TYEL-S-A0004929575-1.pdf?hkey=52A5661711E402568146F3353EA87419&src-supplier=Element14; ComponentLink1Description: https://4donline.ihs.com/images/VipMasterIC/IC/TYEL/TYEL-S-A0004929575/TYEL-S-A0004929575-1.pdf?hkey=52A5661711E402568146F3353EA87419&src-supplier=Element14; ComponentLink2URL: https://4donline.ihs.com/images/VipMasterIC/IC/TYEL/TYEL-S-A0004929575/TYEL-S-A0004929575-1.pdf?hkey=52A5661711E402568146F3353EA87419&src-supplier=Newark; ComponentLink2Description: https://4donline.ihs.com/images/VipMasterIC/IC/TYEL/TYEL-S-A0004929575/TYEL-S-A0004929575-1.pdf?hkey=52A5661711E402568146F3353EA87419&src-supplier=Newark; ComponentLink3URL: https://www.te.com/commerce/DocumentDelivery/DDEController?Action=srchrtrv&DocNm=1773204-3&DocType=DS&DocLang=English&src-supplier=Digi-Key; ComponentLink3Description: https://www.te.com/commerce/DocumentDelivery/DDEController?Action=srchrtrv&DocNm=1773204-3&DocType=DS&DocLang=English&src-supplier=Digi-Key; ComponentLink4URL: https://www.te.com/commerce/DocumentDelivery/DDEController?Action=srchrtrv&amp;DocNm=1773204-3&amp;DocType=DS&amp;DocLang=English&src-supplier=Digi-Key; ComponentLink4Description: https://www.te.com/commerce/DocumentDelivery/DDEController?Action=srchrtrv&amp;DocNm=1773204-3&amp;DocType=DS&amp;DocLang=English&src-supplier=Digi-Key; ComponentLink5URL: https://4donline.ihs.com/images/VipMasterIC/IC/TYEL/TYEL-S-A0004929575/TYEL-S-A0004929575-1.pdf?hkey=52A5661711E402568146F3353EA87419&src-supplier=Farnell; ComponentLink5Description: https://4donline.ihs.com/images/VipMasterIC/IC/TYEL/TYEL-S-A0004929575/TYEL-S-A0004929575-1.pdf?hkey=52A5661711E402568146F3353EA87419&src-supplier=Farnell; Supplier Part Number 1: 73AC9068
TP5 TP6 TP8 TP9 TP14 = CMP-1672-00002-4: PC TEST POINT MULTIPURPOSE RED; Manufacturer: KEYSTONE; Contact Material: Bronze; Mounting Technology: Through Hole; RoHSCompliant: true; Pins: 1; Package Quantity: 100; ComponentLink2Description: Datasheet; Height: 8.12 mm; ComponentLink1URL: http://www.keyelco.com/; DatasheetVersion: Rev. F, 12/2013; Mount: Through Hole; PackageReference: 5010; Contact Plating: Silver; Packaging: Bulk; Colour: Red; REACH SVHC: No SVHC; PackageDescription: 1-Pin Through Hole Device, Dia 3.17 mm; ComponentLink2URL: http://www.keyelco.com/product-pdf.cfm?p=1319; ComponentLink1Description: Manufacturer URL; Manufacturer Part Number: 5010; Value: RED; Package: N/A
TP7 TP13 TP15 = CMP-1672-00003-4: PC TEST POINT MULTIPURPOSE BLACK; Manufacturer: KEYSTONE; ComponentLink2URL: http://www.keyelco.com/product-pdf.cfm?p=1320; Colour: Black; Pins: 1; REACH SVHC: No SVHC; ComponentLink1URL: http://www.keyelco.com/; PackageReference: 5011; Contact Plating: Silver; Package Quantity: 100; Packaging: Bulk; RoHSCompliant: true; Height: 8.12 mm; PackageDescription: 1-Pin Through Hole Device, Dia 3.17 mm; Mount: Through Hole; Mounting Technology: Through Hole; DatasheetVersion: Rev. F, 12/2013; ComponentLink1Description: Manufacturer URL; Contact Material: Bronze; ComponentLink2Description: Datasheet; Manufacturer Part Number: 5011; Value: BLACK; Package: N/A
U6 = CMP-2000-07241-1: DC DC CONVERTER 5V 1W; DC / DC Converter Type: IsolatedPOL; SVHC: NoSVHC(16-Jun-2014); Input Voltage DC Min: 4.5V; Output Current Max: 200mA; DC / DC Converter Mounting: SMD; DC / DC Converter Output Type: Fixed; Input Voltage DC Max: 5.5V; Output Power Max: 1W; Mounting Technology: SurfaceMount; Depth: 16.3mm; Output Voltage Nom.: 5V; Datasheet URL: http://assets.tracopower.com/20160525150431/TES1/documents/tes1-datasheet.pdf; Package Reference: TES 1-0511; Datasheet Version: 05/2016; Width: 8mm; Manufacturer URL: http://www.tracopower.com/home; Package Description: 5-Pin Surface Mount Device, Body 13.7 x 8.0 mm; Height: 7mm; Package: 8-SMD; Manufacturer Part Number: TES 1-0511; Value: N/A
U7 U38 U48 = REF2033QDDCRQ1: AUTOMOTIVE LOW-DRIFT, LOW-POWER,; Supplier 1: Mouser; Manufacturer Part Number: REF2033QDDCRQ1; RoHS: No; Category: Voltage References; Stock 1: 7420; Pricing 1: 1=3.59, 10=3.23, 50=3.23, 100=2.65, 1000=2.02, 10000=1.7 (USD); Supplier Part Number 1: 595-REF2033QDDCRQ1
U12 = R1SE-3.305/H2-R: DC DC CONVERTER 5V 1W; Number of Outputs: 1; Min Input Voltage: 2.97V; Max Input Voltage: 3.63V; Max Output Current: 200mA; Isolation Voltage: 2kV; Efficiency: 75%; Supplier 1: Digi-Key; RoHS: Yes; Category: Board Mount Modules; Stock 1: 563; Pricing 1: 1=4.51000, 5=4.44600, 10=4.38300, 25=4.25800, 50=4.00760, 100=3.88240, 250=3.75720 (USD); Mount: Surface Mount; Case/Package: SMD/SMT; Weight: 1g; Min Operating Temperature: -40°C; Max Operating Temperature: 100°C; Packaging: Cut Tape; Voltage - Output 1: 5V; Min Input Voltage (DC): 2.97V; Max Input Voltage (DC): 3.63V; Max Output Power: 1W; Current - Output 1: 200mA; Max Power Dissipation: 1W; Max Output Voltage: 5V; Series: ECONOLINE R1SE-H2 (1W); Length: 12.75mm; Width: 10.7mm; Height: 6.7mm; Depth: 12.75mm; Reach SVHC Compliant: Yes; Lead Free: Lead Free; RoHS Compliant: Yes; ComponentLink1URL: http://www.farnell.com/datasheets/1905443.pdf?src-supplier=Farnell; ComponentLink1Description: http://www.farnell.com/datasheets/1905443.pdf?src-supplier=Farnell; ComponentLink2URL: http://www.alliedelec.com/images/products/datasheets/bm/1_Datasheets/70595177.pdf?src-supplier=Allied+Electronics; ComponentLink2Description: http://www.alliedelec.com/images/products/datasheets/bm/1_Datasheets/70595177.pdf?src-supplier=Allied+Electronics; ComponentLink3URL: https://www.recom-power.com/pdf/Econoline/R1SE_H2.pdf?src-supplier=Digi-Key; ComponentLink3Description: https://www.recom-power.com/pdf/Econoline/R1SE_H2.pdf?src-supplier=Digi-Key; ComponentLink4URL: http://www.farnell.com/datasheets/1905443.pdf?src-supplier=Element14; ComponentLink4Description: http://www.farnell.com/datasheets/1905443.pdf?src-supplier=Element14; Supplier Part Number 1: 945-R1SE-3.305/H2-RCT-ND; Value: N/A; Package: 8-SMD; Manufacturer Part Number: R1SE-3.305/H2-R